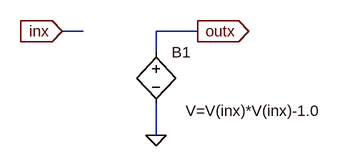
[diagram p0: schematic x2-1_lv1.asc]
x2-1_lv1.asc, the LTspice schematic file:
Version 4.1
SHEET 1 880 680
WIRE 64 96 32 96
WIRE 240 96 176 96
WIRE 176 128 176 96
WIRE 176 256 176 208
FLAG 176 256 0
FLAG 240 96 outx
IOPIN 240 96 Out
FLAG 32 96 inx
IOPIN 32 96 In
SYMBOL bv 176 112 R0
WINDOW 3 46 106 Left 2
SYMATTR Value V=V(inx)*V(inx)-1.0
SYMATTR InstName B1

The netlist it stands for:
* x2-1_lv1.asc
B1 outx 0 V=V(inx)*V(inx)-1.0
.backanno
.end